# EAGLE design tick-mk-4.6.5 (EAGLE 6.5.0)
DESIGNER: schizobovine (sean@yak.net); VERSION: 4.6.5
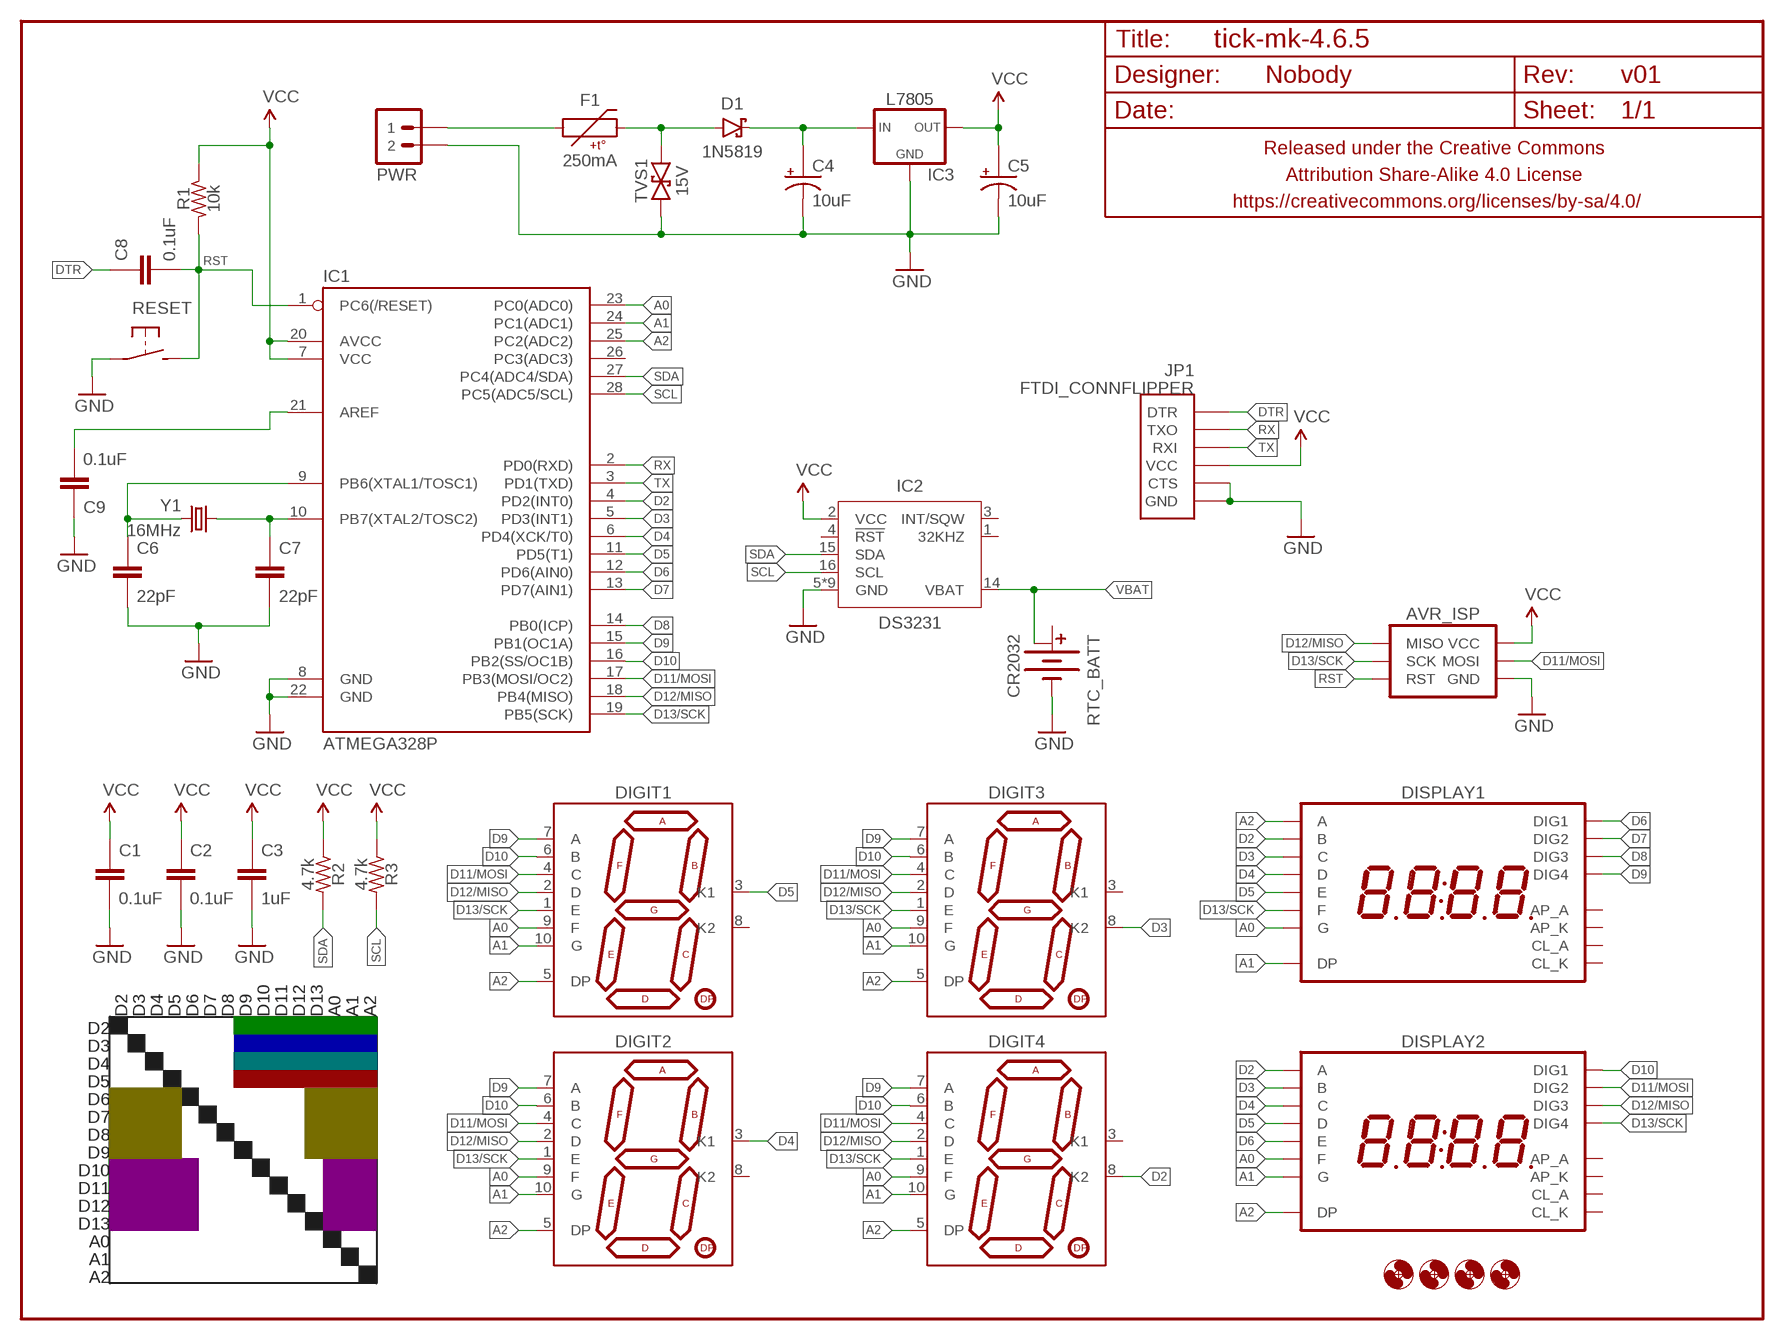
[diagram p0: schematic, sheet 1]

## Parts
AVR_ISP  AVR_SPI_PRG_6PTH  [2X3]
C1  0.1uF  CAPACITOR-CERAMIC025-024X044  [C025-024X044]
C2  0.1uF  CAPACITOR-CERAMIC025-024X044  [C025-024X044]
C3  1uF  CAPACITOR-CERAMIC025-024X044  [C025-024X044]
C4  10uF  CAPACITOR-POLARIZEDE2-5  [E2-5]
C5  10uF  CAPACITOR-POLARIZEDE2-5  [E2-5]
C6  22pF  CAPACITOR-CERAMIC025-024X044  [C025-024X044]
C7  22pF  CAPACITOR-CERAMIC025-024X044  [C025-024X044]
C8  0.1uF  CAPACITOR-CERAMIC025-024X044  [C025-024X044]
C9  0.1uF  CAPACITOR-CERAMIC025-024X044  [C025-024X044]
D1  1N5819  DIODE-SCHOTTKYPTH-10.16MM  [DIODE-10.16MM]
DIGIT1  7SEG_1DIGPTH-25.4MM-BARE  [7SEG_1DIG_25.4MM_NOSILK]
DIGIT2  7SEG_1DIGPTH-25.4MM-BARE  [7SEG_1DIG_25.4MM_NOSILK]
DIGIT3  7SEG_1DIGPTH-25.4MM-BARE  [7SEG_1DIG_25.4MM_NOSILK]
DIGIT4  7SEG_1DIGPTH-25.4MM-BARE  [7SEG_1DIG_25.4MM_NOSILK]
DISPLAY1  7SEG_4DIGIT_COLON_APOS  [7SEG_4DIG_10MM]
DISPLAY2  7SEG_4DIGIT_COLON_APOS  [7SEG_4DIG_10MM]
F1  250mA  PTCPTH-5.08MM  [PTC-PTH-5.08MM]
FRAME1  FRAME-LETTERNO_PACKAGE  [DUMMY]
H1  HOLE#2  [HOLE-#2]
H2  HOLE#2  [HOLE-#2]
H3  HOLE#2  [HOLE-#2]
H4  HOLE#2  [HOLE-#2]
IC1  ATMEGA328P  ATMEGA328P_PDIP  [DIL28-3]
IC2  DS3231  [SO16W]
IC3  L7805  V_REG_78XXTO-220-THERMPAD  [TO220-IGO-THERMPAD]
JP1  FTDI_CONNFLIPPER  [FTDI_CONN_FLIP]
PWR  M02JST-PTH-VERT  [JST-2-PH-VERT-PTH]
R1  10k  RESISTORPTH-AXIAL-7.62MM  [RESISTOR-AXIAL-PTH-7.62MM]
R2  4.7k  RESISTORPTH-AXIAL-6.35MM  [RESISTOR-AXIAL-PTH-6.35MM]
R3  4.7k  RESISTORPTH-AXIAL-6.35MM  [RESISTOR-AXIAL-PTH-6.35MM]
RESET  SPST-NO-TACT3MM-RA  [TACTILE-PTH-SIDE]
RTC_BATT  CR2032  BATTERY-COINCR2032_SMD  [BATTCON_20MM_MINE]
TVS1  15V  TVSDO-41-10.16MM  [DO-41-TVS-BI-10.16MM]
Y1  16MHz  CRYSTALHC49UV  [HC49U-V]

## Nets
A0: DIGIT1.9(F) DIGIT2.9(F) DIGIT3.9(F) DIGIT4.9(F) DISPLAY1.15(G) DISPLAY2.11(F) IC1.23(PC0(ADC0))
A1: DIGIT1.10(G) DIGIT2.10(G) DIGIT3.10(G) DIGIT4.10(G) DISPLAY1.7(DP) DISPLAY2.15(G) IC1.24(PC1(ADC1))
A2: DIGIT1.5(DP) DIGIT2.5(DP) DIGIT3.5(DP) DIGIT4.5(DP) DISPLAY1.14(A) DISPLAY2.7(DP) IC1.25(PC2(ADC2))
D2: DIGIT4.8(K2) DISPLAY1.16(B) DISPLAY2.14(A) IC1.4(PD2(INT0))
D3: DIGIT3.8(K2) DISPLAY1.13(C) DISPLAY2.16(B) IC1.5(PD3(INT1))
D4: DIGIT2.3(K1) DISPLAY1.3(D) DISPLAY2.13(C) IC1.6(PD4(XCK/T0))
D5: DIGIT1.3(K1) DISPLAY1.5(E) DISPLAY2.3(D) IC1.11(PD5(T1))
D6: DISPLAY1.1(DIG1) DISPLAY2.5(E) IC1.12(PD6(AIN0))
D7: DISPLAY1.2(DIG2) IC1.13(PD7(AIN1))
D8: DISPLAY1.6(DIG3) IC1.14(PB0(ICP))
D9: DIGIT1.7(A) DIGIT2.7(A) DIGIT3.7(A) DIGIT4.7(A) DISPLAY1.8(DIG4) IC1.15(PB1(OC1A))
D10: DIGIT1.6(B) DIGIT2.6(B) DIGIT3.6(B) DIGIT4.6(B) DISPLAY2.1(DIG1) IC1.16(PB2(SS/OC1B))
D11/MOSI: AVR_ISP.4(MOSI) DIGIT1.4(C) DIGIT2.4(C) DIGIT3.4(C) DIGIT4.4(C) DISPLAY2.2(DIG2) IC1.17(PB3(MOSI/OC2))
D12/MISO: AVR_ISP.1(MISO) DIGIT1.2(D) DIGIT2.2(D) DIGIT3.2(D) DIGIT4.2(D) DISPLAY2.6(DIG3) IC1.18(PB4(MISO))
D13/SCK: AVR_ISP.3(SCK) DIGIT1.1(E) DIGIT2.1(E) DIGIT3.1(E) DIGIT4.1(E) DISPLAY1.11(F) DISPLAY2.8(DIG4) IC1.19(PB5(SCK))
DTR: C8.1 JP1.DTR
GND: AVR_ISP.6(GND) C1.2 C2.2 C3.2 C4.- C5.- C6.2 C7.2 C9.1 IC1.8(GND) IC1.22(GND) IC2.5(GND) IC2.6(GND) IC2.7(GND) IC2.8(GND) IC2.9(GND) IC2.10(GND) IC2.11(GND) IC2.12(GND) IC2.13(GND) IC3.4(GND) IC3.GND JP1.CTS JP1.GND PWR.2 RESET.1 RTC_BATT.BOTTOM(-) TVS1.P$1
N$1: C9.2 IC1.21(AREF)
N$4: D1.A F1.P$2 TVS1.P$2
N$6: C6.1 IC1.9(PB6(XTAL1/TOSC1)) Y1.2
N$7: F1.P$1 PWR.1
N$8: C4.+ D1.C IC3.IN
N$9: C7.1 IC1.10(PB7(XTAL2/TOSC2)) Y1.1
RST: AVR_ISP.5(RST) C8.2 IC1.1(PC6(/RESET)) R1.P$2 RESET.2
RX: IC1.2(PD0(RXD)) JP1.TXO
SCL: IC1.28(PC5(ADC5/SCL)) IC2.16(SCL) R3.P$2
SDA: IC1.27(PC4(ADC4/SDA)) IC2.15(SDA) R2.P$2
TX: IC1.3(PD1(TXD)) JP1.RXI
VBAT: IC2.14(VBAT) RTC_BATT.TOP@2(+1)
VCC: AVR_ISP.2(VCC) C1.1 C2.1 C3.1 C5.+ IC1.7(VCC) IC1.20(AVCC) IC2.2(VCC) IC3.OUT JP1.VCC R1.P$1 R2.P$1 R3.P$1
Unconnected: DIGIT1.8(K2) DIGIT2.8(K2) DIGIT3.3(K1) DIGIT4.3(K1) DISPLAY1.4(CL_A) DISPLAY1.9(AP_K) DISPLAY1.10(AP_A) DISPLAY1.12(CL_K) DISPLAY2.4(CL_A) DISPLAY2.9(AP_K) DISPLAY2.10(AP_A) DISPLAY2.12(CL_K) IC1.26(PC3(ADC3)) IC2.1(32KHZ) IC2.3(INT/SQW) IC2.4(!RST) RTC_BATT.TOP@1(+)

## Notes on the sheet
- D2 | D3 | D4 | D5 | D6 | D7 | D8 | D9 | D10 | D11 | D12 | D13 | A0 | A1 | A2
- D2
- D3
- D4
- D5
- D6
- D7
- D8
- D9
- D10
- D11
- D12
- D13
- A0
- A1
- A2

## Library data of the parts
AVR_ISP = A_butts:AVR_SPI_PRG_6: AVR ISP 6 Pin This is the reduced ISP connector for AVR programming. Common on Arduino. This footprint will take up less PCB space and can be used with a 10-pin to 6-pin adapter such as SKU: BOB-08508 **Special note about "TEST_POINT" package. The stop mask is on the top side, so if you want your programming test points to be on the bottom of your board, make sure to place this package on the bottom side of the board. This also ensure that the orientation to program from the bottom side will be correct.
C1-C3 C6-C9 = A_butts:CAPACITOR-CERAMIC: CAPACITOR, European symbol
C4 C5 = A_butts:CAPACITOR-POLARIZED: POLARIZED CAPACITOR, American symbol
D1 = A_butts:DIODE-SCHOTTKY: Schottky diodes in SFE's production catalog BAT20J 1A 23V 0.62Vf RB751 120mA 40V 0.37Vf PMEG4005EJ 0.5A 40V 0.42Vf MBRA140 1A 40V 0.5Vf B340A 3A 40V SMA
DIGIT1-DIGIT4 = A_butts:7SEG_1DIG
DISPLAY1 DISPLAY2 = A_butts:7SEG_4DIGIT_COLON_APOS
F1 = A_butts:PTC: Resettable Fuse PTC Resettable Fuse. Spark Fun Electronics SKU : COM-08357
FRAME1 = A_butts:FRAME-LETTER: Schematic Frame Standard 8.5x11 US Letter frame; DESIGNER: Nobody; VERSION: v01
H1-H4 = A_butts:HOLE: MOUNTING HOLE with drill center marker
IC1 = A_butts:ATMEGA328P_PDIP: uC used in the Arduino 32kb flash, 1k EEPROM, 2k SRAM This is the through-hole version of this chip.
IC2 = A_butts:DS3231
IC3 = A_butts:V_REG_78XX: Voltage Regulator Standard 7805 5V regulator. IGO (Input Ground Output). Spark Fun Electronics SKU : COM-00107
JP1 = A_butts:FTDI_CONN: Connector which mates to FTDI basic or FTDI cable.
PWR = A_butts:M02: Standard 2-pin 0.1" header. Use with - straight break away headers ( PRT-00116) - right angle break away headers (PRT-00553) - swiss pins (PRT-00743) - machine pins (PRT-00117) - female headers (PRT-00115) Molex polarized connector foot print use with: PRT-08233 with associated crimp pins and housings. 2.54_SCREWTERM for use with PRT-10571. 3.5mm Screw Terminal footprints for PRT-08084 5mm Screw Terminal footprints for use with PRT-08433
R1-R3 = A_butts:RESISTOR: RESISTOR, American symbol
RESET = A_butts:SPST-NO-TACT
RTC_BATT = A_butts:BATTERY-COIN
TVS1 = A_butts:TVS: Transient voltage suppressor- prevents ESD on inputs. Ignore package description- MBRA140 is NOT this type of part!!!
Y1 = A_butts:CRYSTAL: Various standard crystals. Proven footprints. Spark Fun Electronics SKU : COM-00534

## Board
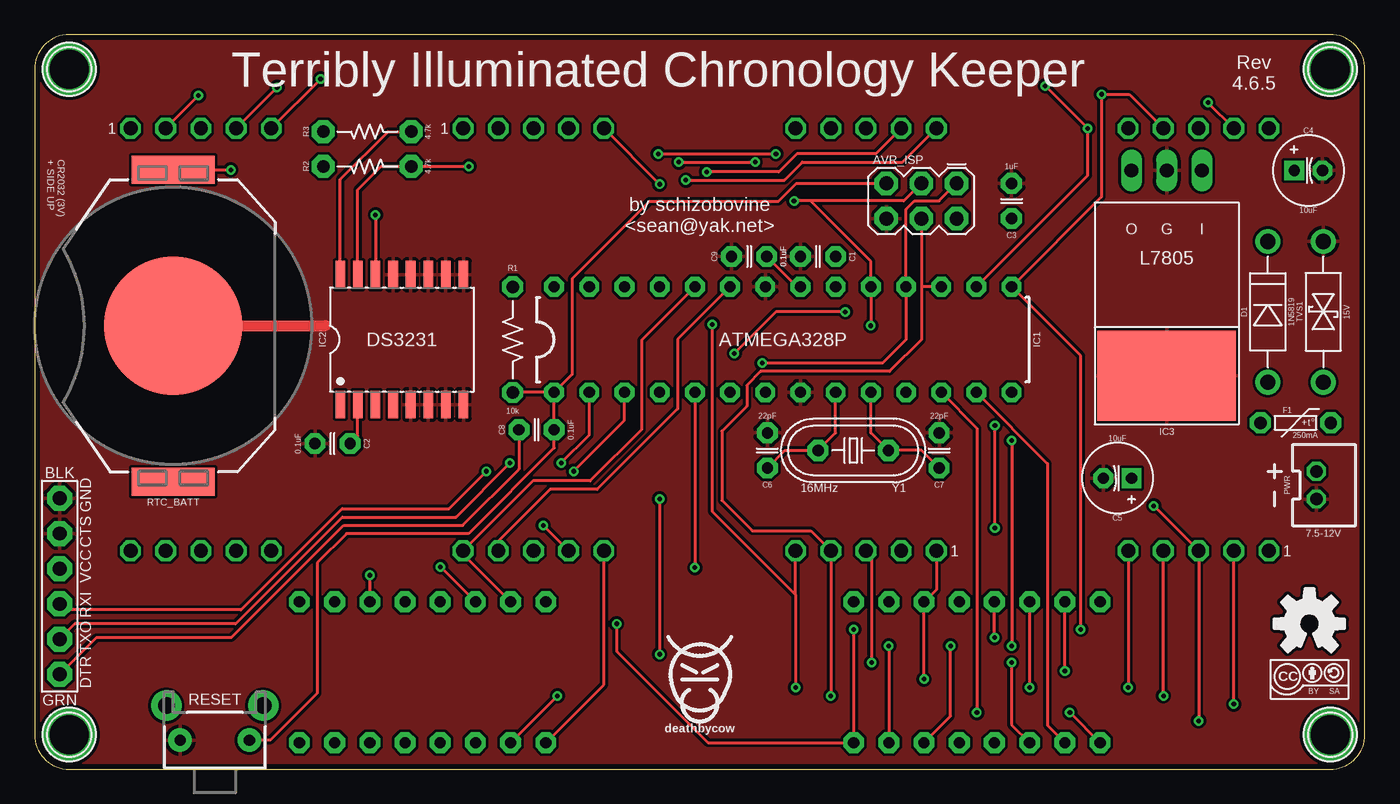
[diagram p1: board, top side]
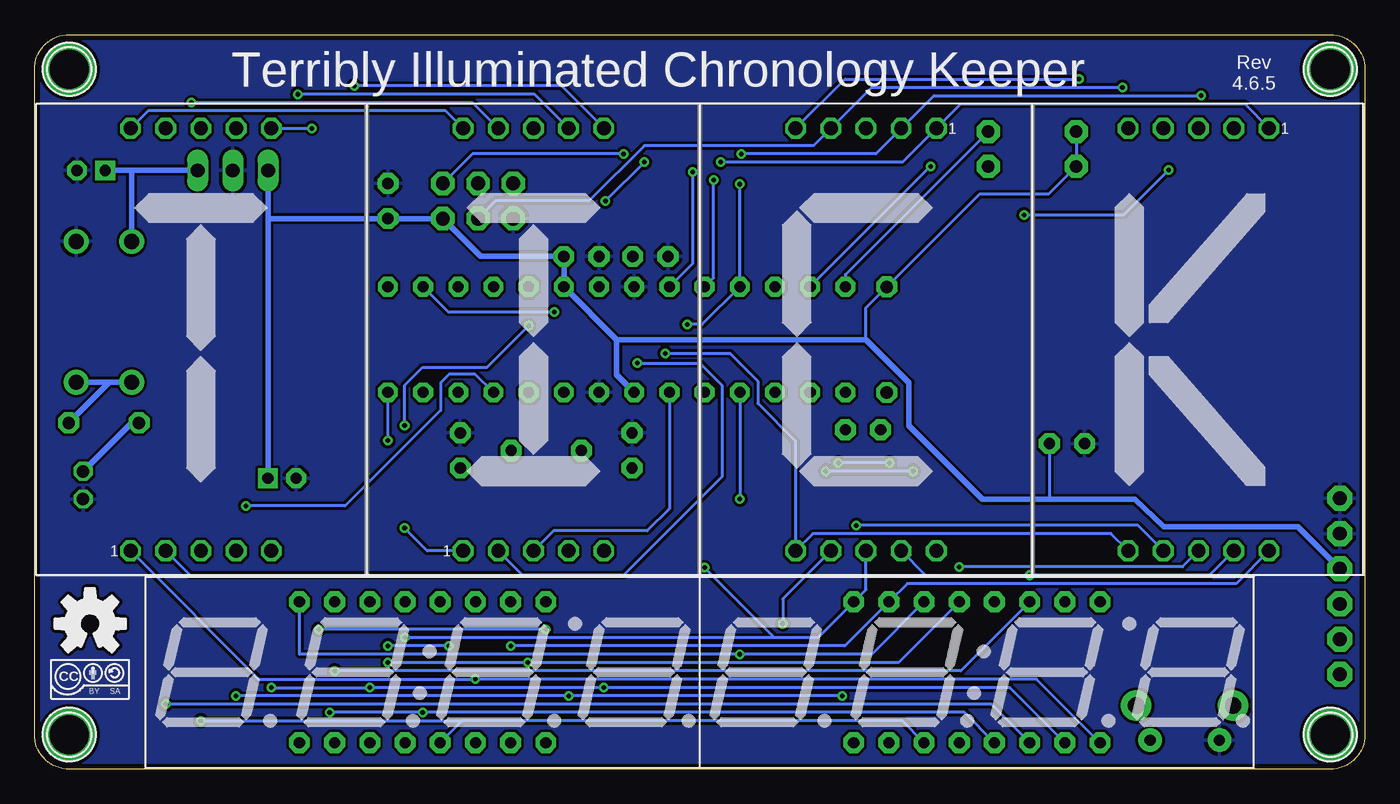
[diagram p2: board, bottom side, seen from below]

Size 96 x 53 mm. Coordinates in mm from the lower left corner, seen from the top.
Outline: 0,50.5 0,2.5 arc90 2.5,0 93.5,0 arc90 96,2.5 96,50.5 arc90 93.5,53 2.5,53 arc90 0,50.5
Copper layers (1*16): Top 0.0356mm / dielectric 1.5011mm / Bottom 0.0356mm
Design rules "LaenPCBOrder_2": minimum track width 6mil, minimum drill 13mil, track to track 6mil, track to pad 6mil, pad to pad 6mil, via to via 6mil, smd to smd 6mil, copper to edge 15mil, drill to drill 6mil, minimum pad ring 7mil, minimum via ring 7mil, stop-mask expansion 3mil, vias tented up to drill 20mil, thermal gap 10mil

### Footprints (pad centres in the part's own frame; a part is rotated, then mirrored left to right if it is on the bottom)
2X3 = drill 1 pad 1.676 octagon: 1 -2.54,-1.27; 2 -2.54,1.27; 3 0,-1.27; 4 0,1.27; 5 2.54,-1.27; 6 2.54,1.27
C025-024X044 = drill 0.813 pad 1.5 octagon: 1 -1.27,0; 2 1.27,0
E2-5 = drill 0.813 pad 1.422 square: + -1.016,0 | drill 0.813 pad 1.422 octagon: - 1.016,0
DIODE-10.16MM = drill 1.1 pad 1.778: A -5.08,0; C 5.08,0
7SEG_1DIG_25.4MM_NOSILK = drill 1 pad 1.5 octagon: 1 -5.08,-15.24; 2 -2.54,-15.24; 3 0,-15.24; 4 2.54,-15.24; 5 5.08,-15.24; 6 5.08,15.24; 7 2.54,15.24; 8 0,15.24; 9 -2.54,15.24; 10 -5.08,15.24
7SEG_4DIG_10MM = drill 0.8 pad 1.5 octagon: 1 -8.89,-5.08; 2 -6.35,-5.08; 3 -3.81,-5.08; 4 -1.27,-5.08; 5 1.27,-5.08; 6 3.81,-5.08; 7 6.35,-5.08; 8 8.89,-5.08; 9 8.89,5.08; 10 6.35,5.08; 11 3.81,5.08; 12 1.27,5.08; 13 -1.27,5.08; 14 -3.81,5.08; 15 -6.35,5.08; 16 -8.89,5.08
PTC-PTH-5.08MM = drill 0.9 pad 1.5 octagon: P$1 -2.54,0; P$2 2.54,0
HOLE-#2 = drill 2.8 pad 3.81: P$1 0,0
DIL28-3 = drill 0.8 pad 1.422 octagon: 1 -16.51,-3.81; 2 -13.97,-3.81; 3 -11.43,-3.81; 4 -8.89,-3.81; 5 -6.35,-3.81; 6 -3.81,-3.81; 7 -1.27,-3.81; 8 1.27,-3.81; 9 3.81,-3.81; 10 6.35,-3.81; 11 8.89,-3.81; 12 11.43,-3.81; 13 13.97,-3.81; 14 16.51,-3.81; 15 16.51,3.81; 16 13.97,3.81; 17 11.43,3.81; 18 8.89,3.81; 19 6.35,3.81; 20 3.81,3.81; 21 1.27,3.81; 22 -1.27,3.81; 23 -3.81,3.81; 24 -6.35,3.81; 25 -8.89,3.81; 26 -11.43,3.81; 27 -13.97,3.81; 28 -16.51,3.81
SO16W = smd 0.7 x 2: 1 -4.445,-4.685; 2 -3.175,-4.685; 3 -1.905,-4.685; 4 -0.635,-4.685; 5 0.635,-4.685; 6 1.905,-4.685; 7 3.175,-4.685; 8 4.445,-4.685; 9 4.445,4.685; 10 3.175,4.685; 11 1.905,4.685; 12 0.635,4.685; 13 -0.635,4.685; 14 -1.905,4.685; 15 -3.175,4.685; 16 -4.445,4.685
TO220-IGO-THERMPAD = smd 10 x 6.5: 4 0,11 | drill 1 long: GND 0,-3.81; IN -2.54,-3.81; OUT 2.54,-3.81
FTDI_CONN_FLIP = drill 1 pad 1.8 octagon: CTS 3.81,0; DTR -6.35,0; GND 6.35,0; RXI -1.27,0; TXO -3.81,0; VCC 1.27,0
JST-2-PH-VERT-PTH = drill 0.9 octagon: 1 -1,0; 2 1,0
RESISTOR-AXIAL-PTH-7.62MM = drill 0.9 pad 1.5 octagon: P$1 -3.81,0; P$2 3.81,0
RESISTOR-AXIAL-PTH-6.35MM = drill 0.9 pad 1.676 octagon: P$1 -3.175,0; P$2 3.175,0
TACTILE-PTH-SIDE = drill 0.8 pad 1.7: 1 -2.5,0; 2 2.5,0 | drill 1.2 pad 2.2: ANCHOR1 -3.5,2.5; ANCHOR2 3.5,2.5
BATTCON_20MM_MINE = smd 10 x 10: BOTTOM 0,0 | smd 6 x 2: TOP@1 0,11.25; TOP@2 0,-11.25
DO-41-TVS-BI-10.16MM = drill 1.1 pad 1.778: P$1 -5.08,0; P$2 5.08,0
HC49U-V = drill 0.813 pad 1.524 octagon: 1 -2.54,0; 2 2.54,0

### Placement (x,y rotation side)
AVR_ISP  64,41 180 top
C1  56.54,37 180 top
C2  21.5,23.5 180 top
C3  70.5,41 90 top
C4  91.92,43.2 0 top
C5  78.14,21 180 top
C6  52.88,23 90 top
C7  65.28,23 90 top
C8  36.22,24.5 0 top
C9  51.56,37 0 top
D1  89,33 90 top
DIGIT1  84,31 0 bottom
DIGIT2  60,31 0 bottom
DIGIT3  36,31 180 bottom
DIGIT4  12,31 180 bottom
DISPLAY1  68,7 0 bottom
DISPLAY2  28,7 0 bottom
F1  91,25 0 top
FRAME1  0,-0.5 0 top
H1  2.5,2.5 0 top
H2  93.5,2.5 0 top
H3  93.5,50.5 0 top
H4  2.5,50.5 0 top
IC1  54,31 0 top
IC2  26.5,31 0 top
IC3  81.7,39.39 180 top
JP1  1.8,13.2 90 top
PWR  92.5,20.5 270 top
R1  34.5,31 270 top
R2  24,43.5 0 top
R3  24,46 0 top
RESET  13,2.1 0 top
RTC_BATT  10,32 180 top
TVS1  93,33 270 top
U$1  [TICK_SYMBOL]  48,31 0 bottom
U$2  [COW_SMALL]  48,7 0 top
U$4  [CC-BY-SA-4.0-NO-URL]  92,6.5 0 top
U$5  [OSHWLOGO_TOP_0.2]  92,10.5 0 top
U$6  [OSHWLOGO_TOP_0.2]  92,10.5 0 bottom
U$7  [CC-BY-SA-4.0-NO-URL]  92,6.5 0 bottom
Y1  59.08,23 180 top

### Tracks (layer width: path | path; a pad name or v marks a point on that pad's centre or on a via)
A0  (via drill 0.33)
  Top 0.2: IC1.23 46.4,31.02 46.4,26 40.6,20.2 37.2,20.2 33.46,16.46 DIGIT3.9 | v74.35,7.1 DISPLAY1.15 | v84.68,48.1 DIGIT1.9 | DIGIT2.9 60.7,44.4 55,44.4 53.7,43.1 v48.5,43.1 | v24.19,14 DISPLAY2.11
  Bottom 0.2: DIGIT4.9 11.22,14 v24.19,14 31.7,14 DIGIT3.9 | DISPLAY2.11 29.17,7.1 v74.35,7.1 | DIGIT2.9 64.4,48.1 v84.68,48.1 | IC1.23 48.5,36.5 v48.5,43.1
A1  (via drill 0.33)
  Top 0.2: IC1.24 43.8,30.96 43.8,24.5 40.1,20.8 35.96,20.8 DIGIT3.10 30.92,15.51 DISPLAY2.15 | v61.65,8.9 DISPLAY1.7 | v47,42.5 54.1,42.5 55.4,43.8 62.64,43.8 DIGIT2.10
  Bottom 0.2: DIGIT4.10 9.28,13.4 33.03,13.4 DISPLAY2.15 37.53,8.9 v61.65,8.9 | DIGIT2.10 66.34,47.5 87.82,47.5 DIGIT1.10 | IC1.24 47,35.46 v47,42.5
A2  (via drill 0.33)
  Top 0.2: v71.81,5.9 DISPLAY1.14 | DIGIT1.5 v78.92,5.9 | v20.64,49.8 DIGIT4.5 | v45.11,42.21 DIGIT3.5 | v48.9,32.1 48.9,18.6 54.92,12.58 | 54.92,12.58 DIGIT2.5 | 54.92,12.58 v54.92,5.9
  Bottom 0.2: DISPLAY2.7 25.63,5.9 v54.92,5.9 v71.81,5.9 v78.92,5.9 | DIGIT3.5 37.52,49.8 v20.64,49.8 | v48.9,32.1 47.82,32.1 IC1.25 v45.11,42.21
D2  (via drill 0.33)
  Top 0.2: v29.29,14.6 DISPLAY2.14 | v45.11,19.5 v45.11,8.3
  Bottom 0.2: DIGIT4.8 13.16,14.6 v29.29,14.6 | DISPLAY2.14 35.59,8.3 v45.11,8.3 76.89,8.3 DISPLAY1.16 | IC1.4 v45.11,19.5
D3  (via drill 0.33)
  Top 0.2: v69.27,9.5 DISPLAY1.13 | IC1.5 v47.65,14.55
  Bottom 0.2: DIGIT3.8 36,12.97 DISPLAY2.16 39.47,9.5 42.6,9.5 | 42.6,9.5 v69.27,9.5 | v47.65,14.55 42.6,9.5
D4  (via drill 0.33)
  Top 0.2: v70.5,7.7 70.5,3.23 DISPLAY1.3 | DIGIT2.3 60.4,15.36 v60.4,7.7
  Bottom 0.2: DISPLAY2.13 33.65,7.7 v60.4,7.7 v70.5,7.7 | IC1.6 50.19,18.81 51.8,17.2 58.56,17.2 DIGIT2.3
D5  (via drill 0.33)
  Top 0.2: v84,3.5 DIGIT1.3 v80.76,19
  Bottom 0.2: DISPLAY2.3 33.39,3.5 65.15,3.5 | 65.15,3.5 DISPLAY1.5 | v84,3.5 65.15,3.5 | v80.76,19 73.6,19 66.7,25.9 66.7,27.9 66.1,28.5 64.2,28.5 IC1.11
D6  (via drill 0.33)
  Top 0.2: v74.71,4.1 DISPLAY1.1 | IC1.12 68,24.62 v68,4.1
  Bottom 0.2: DISPLAY2.5 28.91,4.1 v68,4.1 v74.71,4.1
D7
  Top 0.2: IC1.13 73.1,22.06 73.1,3.17 DISPLAY1.2
D8  (via drill 0.33)
  Top 0.2: v70.51,23.71 v70.51,8.9 | DISPLAY1.6 66.1,3.83 v66.1,8.9
  Bottom 0.2: IC1.14 v70.51,23.71 | v66.1,8.9 v70.51,8.9
D9  (via drill 0.33)
  Top 0.2: v36.7,17.6 DIGIT3.7 | v42,10.5 42,8.5 48.58,1.92 DISPLAY1.8 v59.11,10.1 | v75.5,10.1 75.5,29.82 IC1.15 77,41.3 v77,48.7 79,48.7 DIGIT1.7
  Bottom 0.2: DIGIT4.7 16.38,17.6 v36.7,17.6 | DIGIT3.7 42,12.3 v42,10.5 | v59.11,10.1 v75.5,10.1 | DIGIT2.7 59.92,48.7 v77,48.7
D10  (via drill 0.33)
  Top 0.2: DISPLAY2.1 41.08,6.11 DIGIT3.6 | v58.5,33 53.5,33 v50.5,30 | v72.94,49.3 v76,46.24 76,42.84 IC1.16
  Bottom 0.2: DIGIT4.6 18.32,17 39.84,17 DIGIT3.6 41.08,23.68 43.8,26.4 43.8,28 45.8,30 v50.5,30 | IC1.16 66.16,33 v58.5,33 | DIGIT2.6 57.98,49.3 v72.94,49.3 | DIGIT1.6 v76,46.24
D11/MOSI  (via drill 0.33)
  Top 0.2: DISPLAY2.2 v37.73,5.3 | v81.46,5.3 DIGIT1.4 | v57.46,5.3 DIGIT2.4 56.02,17.2 51.8,17.2 49.6,19.4 49.6,24.4 51.4,26.2 51.4,27.7 52.4,28.7 61.7,28.7 64,31 64,34.81 | v17.5,49.2 DIGIT4.4 | AVR_ISP.4 64,34.81 | IC1.17 64,34.81
  Bottom 0.2: v37.73,5.3 v57.46,5.3 v81.46,5.3 | v17.5,49.2 35.58,49.2 DIGIT3.4 39.78,45 52,45 56,41 62.73,41 AVR_ISP.4
D12/MISO  (via drill 0.33)
  Top 0.2: v86.54,4.7 DIGIT1.2 | v11.82,48.6 DIGIT4.2 | v45,44.4 v53.5,44.4 | AVR_ISP.1 65.27,41 63.5,41 62.89,40.39 IC1.18 62.89,30.99 61.2,29.3 v52.5,29.3
  Bottom 0.2: DISPLAY2.6 26.97,4.7 v86.54,4.7 | v11.82,48.6 31.1,48.6 DIGIT3.2 35.3,44.4 v45,44.4 | v53.5,44.4 64.41,44.4 AVR_ISP.1 | v52.5,29.3 48,29.3 46.4,27.7 46.4,21.1 53.5,14 60.78,14 | DIGIT1.2 84.78,14 60.78,14 | 60.78,14 DIGIT2.2
D13/SCK  (via drill 0.33)
  Top 0.2: v64.19,6.5 DISPLAY1.11 65.08,12.97 DIGIT2.1 | v46.5,43.8 v52,43.8 | 56,41 62.73,41 AVR_ISP.3 | 56,41 60.35,36.65 IC1.19 v60.35,32 | v69.3,17.4 v69.3,24.8 | 56,41 v54.8,41
  Bottom 0.2: DISPLAY2.8 23.69,6.5 v64.19,6.5 79.82,6.5 DIGIT1.1 | DIGIT4.1 8.68,48 29.16,48 DIGIT3.1 33.36,43.8 v46.5,43.8 | v52,43.8 v54.8,41 | v60.35,32 63.35,29 68,29 69.3,27.7 v69.3,24.8 | DIGIT2.1 67.66,15.76 v69.3,17.4
DTR
  Top 0.2: C8.1 34.95,21.65 30.9,17.6 22.3,17.6 14.2,9.5 4.45,9.5 JP1.DTR
GND
  Top 0.8: RTC_BATT.BOTTOM 21,32
  pour Top (isolate 0.2): 93.5,0 2.5,0 arc-90 0,2.5 0,50.5 arc-90 2.5,53 93.5,53 arc-90 96,50.5 96,2.5 arc-90
  pour Bottom (isolate 0.2): 2.5,53 93.5,53 arc-90 96,50.5 96,2.5 arc-90 93.5,0 2.5,0 arc-90 0,2.5 0,50.5 arc-90
N$1
  Top 0.2: C9.2 55.02,34.81 IC1.21
N$4
  Bottom 0.4: TVS1.P$2 D1.A 90.62,27.92 F1.P$2
N$5
  cutout Top: 10,22 arc-90 0,32 arc-90 10,42 arc-90 20,32 arc-90
N$6
  Top 0.2: C6.1 54.15,23 Y1.2 57.81,24.27 IC1.9
N$7
  Bottom 0.4: F1.P$1 89,25 PWR.1
N$8
  Bottom 0.4: IC3.IN 89,43.2 | 89,43.2 C4.+ | D1.C 89,43.2
N$9
  Top 0.2: IC1.10 60.35,24.27 Y1.1 64.01,23 C7.1
RST
  Top 0.2: IC1.1 C8.2 37.49,23.19 31.3,17 22.5,17 20.4,14.9 20.4,5.5 17,2.1 RESET.2 | AVR_ISP.5 54.97,42.27 53.67,40.97 44.37,40.97 38.8,35.4 38.8,28.5 IC1.1 | IC1.1 R1.P$2
RX  (via drill 0.33)
  Top 0.2: v34.3,22.1 30.4,18.2 22.2,18.2 14.49,10.49 2.9,10.49 JP1.TXO | v38,22.1 40.03,24.13 IC1.2
  Bottom 0.2: v34.3,22.1 v38,22.1
SCL
  Top 0.2: IC2.16 22.05,42.55 25.5,46 R3.P$2
  Bottom 0.2: R3.P$2 37.49,35.69 IC1.28
SDA  (via drill 0.33)
  Top 0.2: v31.34,43.5 R2.P$2 25,43.5 23.32,41.83 IC2.15
  Bottom 0.2: v31.34,43.5 IC1.27
TX  (via drill 0.33)
  Top 0.2: v32.6,21.5 29.9,18.8 22.2,18.8 14.9,11.5 2.23,11.5 JP1.RXI | v38.9,21.5 42.57,25.17 IC1.3
  Bottom 0.2: v32.6,21.5 v38.9,21.5
VBAT  (via drill 0.33)
  Top 0.2: v24.59,40 IC2.14 | RTC_BATT.TOP@2 v14.15,43.25
  Bottom 0.2: v14.15,43.25 17.4,40 v24.59,40
VCC
  Top 0.2: IC2.2 23.32,24.05 C2.1
  Bottom 0.2: R3.P$1 R2.P$1 22.82,41.5 27.81,41.5 R1.P$1 36,33.31 36,31 | C2.1 22.77,19.5
  Bottom 0.4: 54,31 IC1.20 C1.1 63.81,37 AVR_ISP.2 C3.1 79.13,39.73 79.16,39.7 | 54,31 36,31 32.9,27.9 32.9,24.8 27.6,19.5 22.77,19.5 16.6,19.5 14.5,17.5 4.83,17.5 JP1.VCC | C5.+ 79.16,39.7 | 79.16,39.7 IC3.OUT | 54,31 54,28.46 IC1.7

### Text on the board
tPlace: Rev | Terribly Illuminated Chronology Keeper | CR2032 (3V) / + SIDE UP | by schizobovine / <sean@yak.net> | 7.5-12V
bPlace: Rev | Terribly Illuminated Chronology Keeper